# Altium schematic sheet SpeedACQ.SchDoc: SpeedACQ
size A4; Author: João Guimarães; Organization: Altium Limited; Address1: L3, 12a Rodborough Rd; Address2: Frenchs Forest; Address3: NSW; Address4: Australia 2086; Revision: 2.0; SheetNumber: 4; SheetTotal: 9
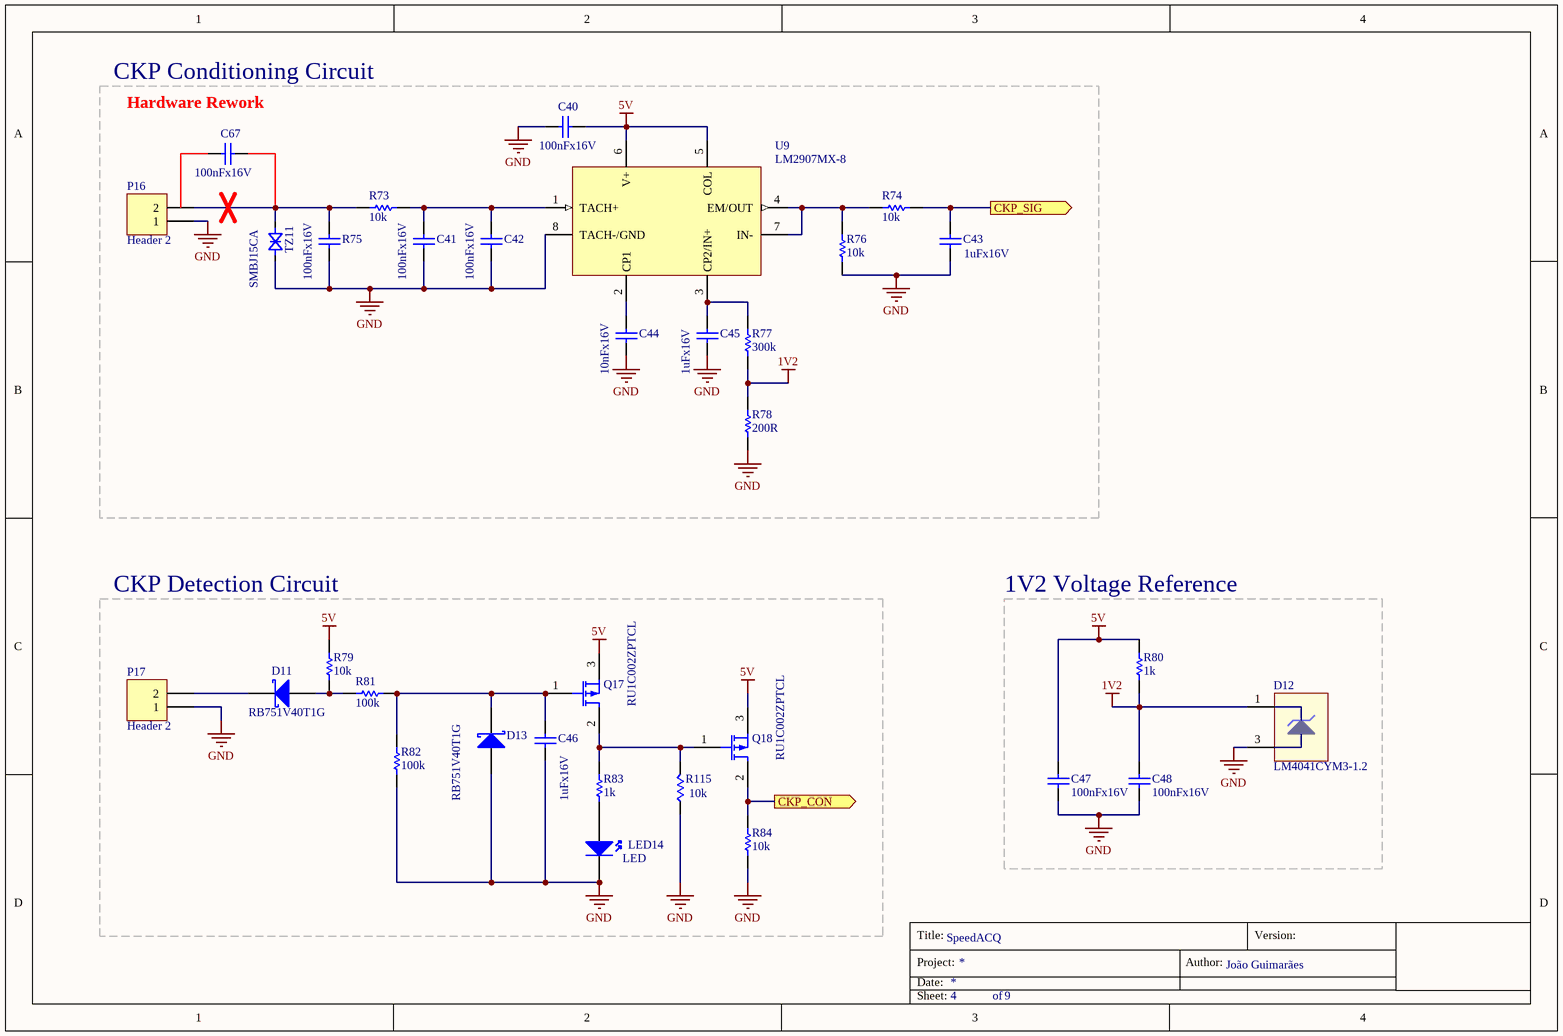
[diagram p0: SpeedACQ.SchDoc]

## Parts
C40  100nFx16V  [DISC-0805]
C41  100nFx16V  [DISC-0805]
C42  100nFx16V  [DISC-0805]
C43  1uFx16V  [DISC-0805]
C44  10nFx16V  [DISC-0805]
C45  1uFx16V  [DISC-0805]
C46  1uFx16V  [DISC-0805]
C47  100nFx16V  [DISC-0805]
C48  100nFx16V  [DISC-0805]
C67  100nFx16V  [DISC-0805]
D11  RB751V40T1G  [DISC-SOD-323]
D12  LM4041CYM3-1.2  [DISC-SOT-23]
D13  RB751V40T1G  [DISC-SOD-323]
LED14  LED  [DISC-LED-0.1-PTH]
P16  Header 2  [CON-FLEXWIRE-0.5MM2-1X2]
P17  Header 2  [CON-FLEXWIRE-0.5MM2-1X2]
Q17  RU1C002ZPTCL  [DISC-SOT-23]
Q18  RU1C002ZPTCL  [DISC-SOT-23]
R73  10k  [DISC-0805]
R74  10k  [DISC-0805]
R75  100nFx16V  [DISC-0805]
R76  10k  [DISC-0805]
R77  300k  [DISC-0805]
R78  200R  [DISC-0805]
R79  10k  [DISC-0805]
R80  1k  [DISC-0805]
R81  100k  [DISC-0805]
R82  100k  [DISC-0805]
R83  1k  [DISC-0805]
R84  10k  [DISC-0805]
R115  10k  [DISC-0805]
TZ11  SMBJ15CA  [DISC-DO214-AA]
U9  LM2907MX-8  [CI-SOIC-8]

## Blocks framed on the sheet
CKP Conditioning Circuit: C40-C45 C67 P16 R73-R78 TZ11 U9
CKP Detection Circuit: C46 D11 D13 LED14 P17 Q17 Q18 R79 R81-R84 R115
1V2 Voltage Reference: C47 C48 D12 R80

## Ports
CKP_CON (out), CKP_SIG (out)

## Nets
1V2: C48.1 D12.1(A) R77.2 R78.1 R80.2
5V: C40.1 C47.1 Q17.3(S) Q18.3(S) R79.1 R80.1 U9.5(COL) U9.6(V+)
GND: C40.2 C41.1 C42.1 C43.1 C44.1 C45.1 C46.1 C47.2 C48.2 D12.3(K) D13.1(A) LED14.2(K) P16.1 P17.1 R75.1 R76.2 R78.2 R82.1 R84.2 R115.1 TZ11.1(A) U9.8(TACH-/GND)
CKP_CON: Q18.2(D) R84.1 ; port CKP_CON
CKP_SIG: C43.2 R74.2 ; port CKP_SIG
NetC41_2: C41.2 C42.2 R73.1 U9.1(TACH+)
NetC44_2: C44.2 U9.2(CP1)
NetC45_2: C45.2 R77.1 U9.3(CP2/IN+)
NetC46_2: C46.2 D13.2(K) Q17.1(G) R81.1 R82.2
NetC67_2: C67.2 P16.2 R73.2 R75.2 TZ11.2(K)
NetD11_1: D11.1(A) R79.2 R81.2
NetD11_2: D11.2(K) P17.2
NetLED14_1: LED14.1(A) R83.1
NetQ17_2: Q17.2(D) Q18.1(G) R83.2 R115.2
NetR74_1: R74.1 R76.1 U9.4(EM/OUT) U9.7(IN-)

Not connected (* = marked no-connect by the designer): C67 1; D12 2

## Notes on the sheet
- (near C67) Hardware Rework
- Title:
- Project:
- Date:
- Author:
- Version:
- Sheet:
- of

## Library data of the parts
C40-C48 C67 R75 = Cap: Capacitor
D11 D13 = D Schottky: Schottky Diode; Published: 8-Jun-2000; LatestRevisionDate: 17-Jul-2002; LatestRevisionNote: Re-released for DXP Platform.; PackageReference: SMB; Publisher: Altium Limited; PackageDescription: DO-214-AA/SMB; 2 C-Bend Leads; Body 5.3 x 3.6 mm, inc. leads (LxW); Code_JEDEC: DO-214-AA
D12 = LM4040: Shunt Voltage References
P16 P17 = Header 2: Header, 2-Pin; LatestRevisionDate: 17-Jul-2002; LatestRevisionNote: Re-released for DXP Platform.; Publisher: Altium Limited
Q17 Q18 = Transistor-PMOS: P-Channel MOSFET
R73 R74 R76-R84 = Res: Resistor
R115 = RESISTOR: PartNumber1: *; Manufacturer1: *; ClassName: *; Price: *; PriceType: FOB
TZ11 = TVZ-Bi-Directional
U9 = LM2907MX-8: Voltage to Frequency & Frequency to Voltage Frequency to Voltage Converter